# Altium project ENZ_Zdroj.PrjPcb
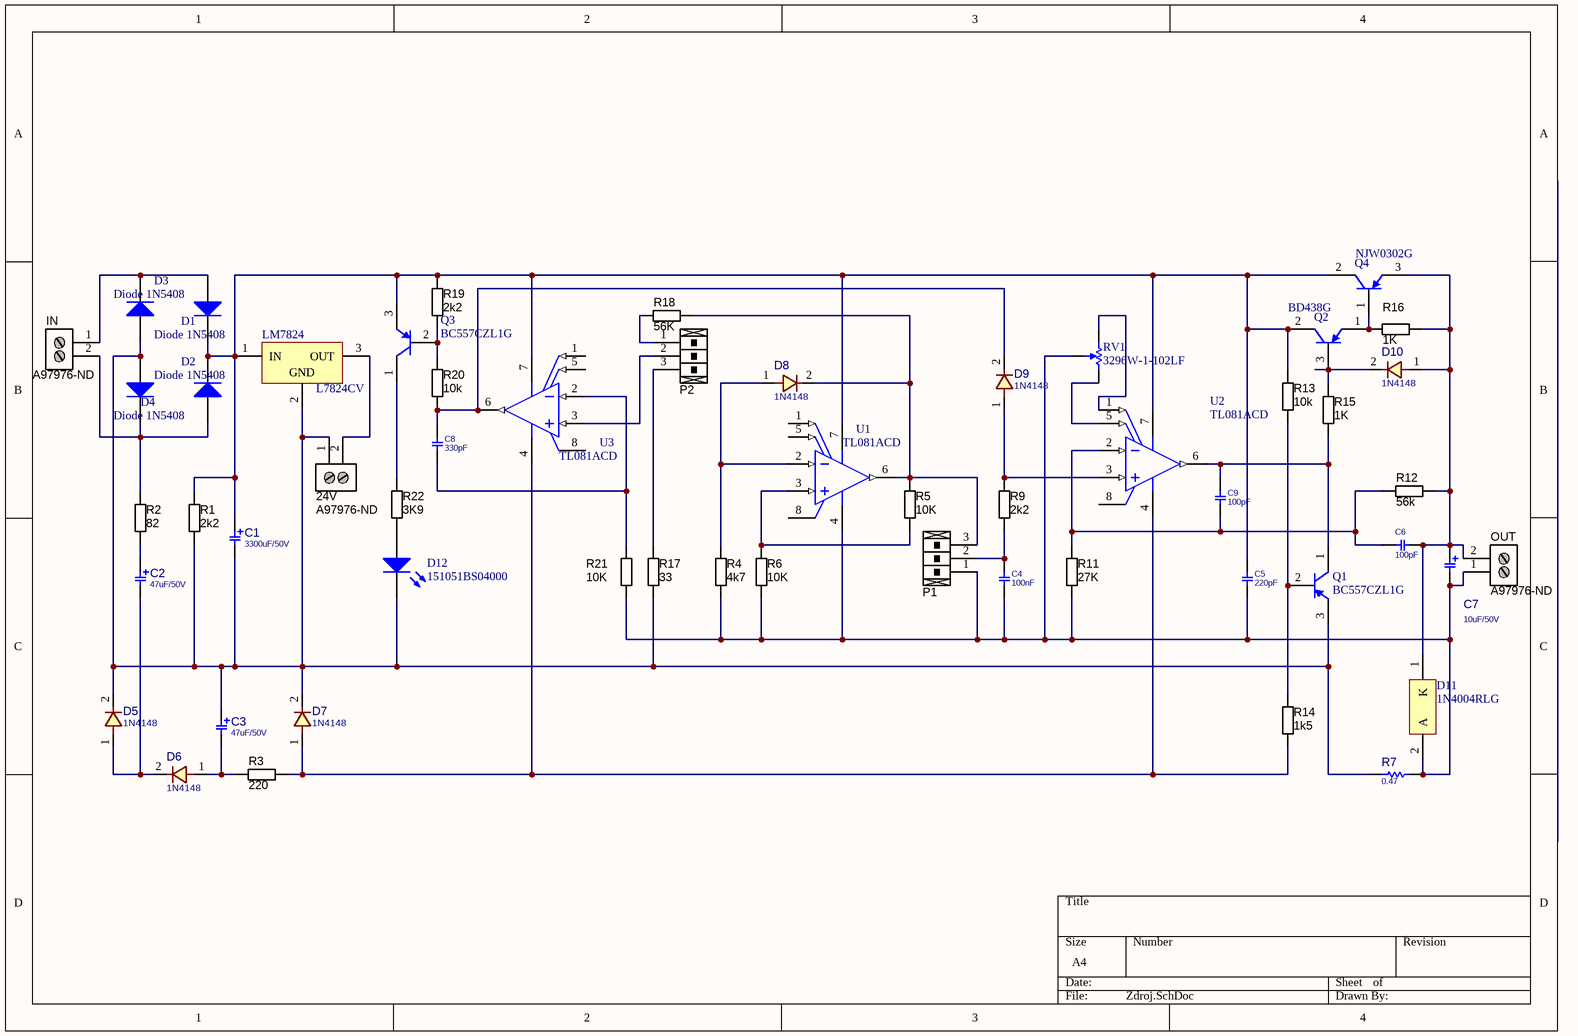
[diagram p0: Zdroj.SchDoc]
1 sheet, 55 parts. Net scope: global (net labels, ports and power ports of the same name join across sheets).
Board file: ENZ_Zdroj_PCB.PcbDoc

## Sheet Zdroj.SchDoc
size A4

### Parts
24V  Supplier Part Number 1: A97976-ND  [2P_PCB_ScrewTerm_90S_3.81MM]  (hidden comment: Stackable ScrewTerm)
C1  3300uF/50V  [C_EL_18X35]
C2  47uF/50V  [C_EL_8X12]
C3  47uF/50V  [C_EL_8X12]
C4  100nF  [C_CER_D3]
C5  220pF  [C_CER_D3]
C6  100pF  [C_CER_D3]
C7  10uF/50V  [C_EL_8X12]
C8  330pF  [C_CER_D3]
C9  100pF  [C_CER_D3]
D1  Diode 1N5408  [DO-201AD]
D2  Diode 1N5408  [DO-201AD]
D3  Diode 1N5408  [DO-201AD]
D4  Diode 1N5408  [DO-201AD]
D5  1N4148  [D_AX02_DO35]
D6  1N4148  [D_AX02_DO35]
D7  1N4148  [D_AX02_DO35]
D8  1N4148  [D_AX02_DO35]
D9  1N4148  [D_AX02_DO35]
D10  1N4148  [D_AX02_DO35]
D11  1N4004RLG  [ONSC-AXIAL_LEAD-2-59-10_P]
D12  151051BS04000  [Type 5mm]
IN  Supplier Part Number 1: A97976-ND  [2P_PCB_ScrewTerm_90S_3.81MM]  (hidden comment: Stackable ScrewTerm)
LM7824  L7824CV  [TO220]
OUT  Supplier Part Number 1: A97976-ND  [2P_PCB_ScrewTerm_90S_3.81MM]  (hidden comment: Stackable ScrewTerm)
P1  3P_TERM BLOCK HEADER  [3P_PCB_TERM_BLOCK_HDR]  (value not drawn)
P2  3P_TERM BLOCK HEADER  [3P_PCB_TERM_BLOCK_HDR]  (value not drawn)
Q1  BC557CZL1G  [ONSC-TO-92-3-29-11_AM_BL]
Q2  BD438G  [ONSC-TO-225-3-77-09]
Q3  BC557CZL1G  [ONSC-TO-92-3-29-11_AM_BL]
Q4  NJW0302G  [ONSC-TO-3P-3LD-3-340AB-01]
R1  value 2k2  [RESTH_AXIAL-0.4]  (hidden comment: Carbon Film)
R2  value 82  [RESTH_AXIAL-0.4]  (hidden comment: Carbon Film)
R3  value 220  [RESTH_AXIAL-0.4]  (hidden comment: Carbon Film)
R4  value 4k7  [RESTH_AXIAL-0.4]  (hidden comment: Carbon Film)
R5  value 10K  [RESTH_AXIAL-0.4]  (hidden comment: Carbon Film)
R6  value 10K  [RESTH_AXIAL-0.4]  (hidden comment: Carbon Film)
R7  0.47  [RWW5W]
R9  value 2k2  [RESTH_AXIAL-0.4]  (hidden comment: Carbon Film)
R11  value 27K  [RESTH_AXIAL-0.4]  (hidden comment: Carbon Film)
R12  value 56k  [RESTH_AXIAL-0.4]  (hidden comment: Carbon Film)
R13  value 10k  [RESTH_AXIAL-0.4]  (hidden comment: Carbon Film)
R14  value 1k5  [RESTH_AXIAL-0.4]  (hidden comment: Carbon Film)
R15  value 1K  [RESTH_AXIAL-0.4]  (hidden comment: Carbon Film)
R16  value 1K  [RESTH_AXIAL-0.4]  (hidden comment: Carbon Film)
R17  value 33  [RESTH_AXIAL-0.4]  (hidden comment: Carbon Film)
R18  value 56K  [RESTH_AXIAL-0.4]  (hidden comment: Carbon Film)
R19  value 2k2  [RESTH_AXIAL-0.4]  (hidden comment: Carbon Film)
R20  value 10k  [RESTH_AXIAL-0.4]  (hidden comment: Carbon Film)
R21  value 10K  [RESTH_AXIAL-0.4]  (hidden comment: Carbon Film)
R22  value 3K9  [RESTH_AXIAL-0.4]  (hidden comment: Carbon Film)
RV1  3296W-1-102LF  [BOUR-3296W-1-3]
U1  TL081ACD  [D0008A_M]
U2  TL081ACD  [D0008A_M]
U3  TL081ACD  [D0008A_M]

### Nets
Net24V_1: 24V.1 C1.2 C3.1 D3.1(A) D4.1(A) D5.2 D7.2 D12.1(K) LM7824.2(GND) Q1.3(E) R1.2 R7.1 R17.2
Net24V_2: 24V.2 LM7824.3(OUT)
NetC1_1: C1.1 C5.2 D1.2(K) D2.2(K) LM7824.1(IN) Q2.2(C) Q3.3(E) Q4.2(C) R1.1 R13.1 R19.1 U1.7(VCC+) U2.7(VCC+) U3.7(VCC+)
NetC2_1: C2.1 R2.2
NetC2_2: C2.2 D5.1 D6.2
NetC3_2: C3.2 D6.1 R3.1
NetC4_1: C4.1 C5.1 C7.2 D11.2(A) OUT.1 P1.1 R4.2 R6.2 R7.2 R11.2 R21.2 RV1.3(TAP) U1.4(VCC-)
NetC4_2: C4.2 P1.2 R9.2
NetC6_1: C6.1 C7.1 D10.1 D11.1(K) OUT.2 Q4.3(E) R12.2 R16.2
NetC6_2: C6.2 C9.1 R11.1 R12.1 U2.2(IN-)
NetC8_1: C8.1 R21.1 U3.2(IN-)
NetC8_2: C8.2 D9.2 R20.2 U3.6(OUT)
NetC9_2: C9.2 Q1.1(C) R15.2 U2.6(OUT)
NetD1_1: D1.1(A) D3.2(K) IN.1
NetD2_1: D2.1(A) D4.2(K) IN.2 R2.1
NetD7_1: D7.1 R3.2 R14.2 U2.4(VCC-) U3.4(VCC-)
NetD8_1: D8.1 R4.1 U1.2(IN-)
NetD8_2: D8.2 P1.3 R5.2 R18.2 U1.6(OUT)
NetD9_1: D9.1 R9.1 U2.3(IN+)
NetD10_2: D10.2 Q2.3(B) R15.1
NetD12_2: D12.2(A) R22.2
NetP2_1: P2.1 R18.1
NetP2_2: P2.2 U3.3(IN+)
NetP2_3: P2.3 R17.1
NetQ1_2: Q1.2(B) R13.2 R14.1
NetQ2_1: Q2.1(E) Q4.1(B) R16.1
NetQ3_1: Q3.1(C) R22.1
NetQ3_2: Q3.2(B) R19.2 R20.1
NetR5_1: R5.1 R6.1 U1.3(IN+)
NetRV1_1: RV1.1(A) U2.1(OFFSET_N1)
NetRV1_2: RV1.2(B) U2.5(OFFSET_N2)

Not connected (* = marked no-connect by the designer): U1 1(OFFSET_N1) 5(OFFSET_N2) 8(NC); U2 8(NC); U3 1(OFFSET_N1) 5(OFFSET_N2) 8(NC)

### Library data of the parts
24V IN OUT = 2P_ScrewTerm_90S_3.81MM: Terminal Block Screw Type THT 2-Position 3.81mm pitch; Manufacturer 1: Tyco Electronics; Manufacturer Part Number 1: 1776113-2; Value: 2 position; Pitch: 0.150" (3.81mm); Positions Per Level: 2; SCDType: undef; Package / Case: Side Entry; 3.81mm pitch; Category: Connectors Interconnects; Color: Black; Supplier 1: Digi-Key
C1-C3 C7 = CAP_THD_EL: CAP, THD, ELEC,; MANF_P#: MANF_PART#; PARAM2: 20%; DESC: DESCRIPTION; DIST#: MOUSER; PARAM: 25V; PRICE: 10= 5$; MANF: MANF; ASSEMBLY: ASSEMBLY
  C1: VALUE: 3300uF/50V
  C2 C3: VALUE: 47uF/50V
  C7: VALUE: 10uF/50V
C4-C6 C9 = CAP_THD_CERML: CAP, THD, CER MULTI LAYER; PARAM: 50V; DESC: CAP, CER MULTI LAYER,; MANF_P#: MANF_PART#; PRICE: 100= 1$; MANF: MANF; PARAM2: PARAM2; ASSEMBLY: ASSEMBLY
  C4: VALUE: 100nF
  C5: VALUE: 220pF
  C6 C9: VALUE: 100pF
C8 = CAP_THD_CERML: CAP, THD, CER MULTI LAYER,; DESC: CAP, CER MULTI LAYER,; MANF_P#: MANF_PART#; PARAM2: 50V; PRICE: 100= 1$; MANF: MANF; ASSEMBLY: ASSEMBLY; VALUE: 330pF
D1-D4 = Diode 1N5408: 3 Amp Medium Power Silicon Rectifier Diode; Published: 8-Jun-2000; LatestRevisionDate: 17-Jul-2002; LatestRevisionNote: Re-released for DXP Platform.; DatasheetVersion: Aug-1984; PackageReference: DO-201AD; Publisher: Altium Limited; PackageDescription: Diode, Axial; Body 9.5 x 5.3 mm (LxDia. max), Lead Dia. 1.32 mm (max); ComponentLink1Description: Manufacturer Link; ComponentLink1URL: http://www.irf.com/
D5-D10 = DIODE_THD_1N4148: DIODE, FAST SWTICHING, THD; DESC: DESCRIPTION; PARAM: 75V; PARAM2: 0.3A; MANF: MANF; ASSEMBLY: ASSEMBLY; PRICE: PRICE; MANF_P#: 1N4148; VALUE: 1N4148
D11 = CMP-0902-00098-1: Standard Recovery Rectifier, 2-Pin Axial_Lead, Pb-Free, Tape and Reel; Manufacturer: On Semiconductor; IO(rec) Max (A): 1; IFSM Max (A): 30; VRRM Max (V): 400; ComponentLink2Description: Datasheet; Packing: Tape and Reel; PackageReference: AXIAL_LEAD-2-59-10; PackageDescription: 2-Pin, Axial Lead, Diameter 2.35 mm; DatasheetVersion: Rev. 13; ComponentLink2URL: http://www.onsemi.com/pub_link/Collateral/1N4001-D.PDF; Type: Standard Recovery; PartNumber: 1N4004RLG; ComponentLink3Description: Package Specification; ComponentLink3URL: http://www.onsemi.cn/pub_link/Collateral/59-10.PDF; ComponentLink1Description: Manufacturer URL; RoHS: TRUE; PackageVersion: Rev. U, 02/2005; ComponentLink1URL: http://www.onsemi.com/; Mounting Technology: Through Hole
D12 = CMP-1488-00009-1: THT LED round mono-color color lens, WL-TMRW, Blue; Manufacturer: Wuerth Elektronik; PackageReference: Type 5mm; ComponentLink2Description: Datasheet; ComponentLink1Description: Manufacturer URL; Emitting color: Blue; ComponentLink1URL: http://www.we-online.com; PartNumber: 151051BS04000; ComponentLink2URL: http://katalog.we-online.de/pbs/datasheet/7448042001.pdfhttp://katalog.we-online.de/pbs/datasheet/7448042001.pdfhttp://katalog.we-online.de/pbs/datasheet/7448042001.pdfhttp://katalog.we-online.de/pbs/datasheet/151051BS04000.pdf
LM7824 = CMP-0244-00424-1: Positive Voltage Regulator, 24V, 3-Pin TO-220; ComponentLink3Description: Package Specification; DatasheetVersion: 16/11/2011; ComponentLink1Description: Manufacturer URL; PackageReference: TO220; ComponentLink2Description: Datasheet; PackageVersion: ver3.0; ComponentLink3URL: http://www.st.com/internet/com/TECHNICAL_RESOURCES/TECHNICAL_LITERATURE/PACKAGE_INFORMATION/CD00004649.pdf; ComponentLink1URL: http://www.st.com; PackageDescription: TO, Thru-Hole, Vertical, Heatsink Mounted; 3 In-Line Leads; Pitch 2.54 mm; ComponentLink2URL: http://www.st.com/internet/com/TECHNICAL_RESOURCES/TECHNICAL_LITERATURE/DATASHEET/CD00000444.pdf
P1 P2 = 3P_TERM BLOCK HEADER: Terminal Block THT 3-Position header 3.81mm pitch; Manufacturer 1: TE Connectivity; Manufacturer Part Number 1: 284517-3; Pitch: 0.150" (3.81mm); Voltage: 300V; Mating Connector: 284507-3; Value: 3 position; Positions Per Level: 3; SCDType: undef; Category: Connectors; Mounting Type: Through Hole; Terminal Block Type: Header, Male Pins, Shrouded (4 Side); Package / Case: Side Entry; 3.81mm pitch; Supplier 1: Digi-Key; Supplier Part Number 1: A98411-ND; ComponentLink1URL: http://www.te.com/commerce/DocumentDelivery/DDEController?Action=srchrtrv&DocNm=284517&DocType=Customer+Drawing&DocLang=English; ComponentLink1Description: http://www.te.com/commerce/DocumentDelivery/DDEController?Action=srchrtrv&DocNm=284517&DocType=Customer+Drawing&DocLang=English
Q1 Q3 = CMP-1048-01521-1: Amplifier Transistor, PNP Silicon, 3-Pin TO-92, Pb-Free, Ammo Box; Manufacturer: On Semiconductor; IC Continuous (A): -0.1; ComponentLink2Description: Datasheet; ComponentLink1URL: http://www.onsemi.com/; Mounting Technology: Through Hole; PartNumber: BC557CZL1G; Packing: Ammo Box; DatasheetVersion: Rev. 3; PackageVersion: Rev. AM; ComponentLink3URL: http://www.onsemi.com/pub_link/Collateral/MAC97-D.PDF; ComponentLink1Description: Manufacturer URL; Polarity: PNP; RoHS: TRUE; PackageReference: TO-92-3-29-11_AM_BL; PackageDescription: 3-Pin Transistor Outline, Body 4.825 x 3.685 mm, Pitch 1.27 mm; ComponentLink2URL: http://www.onsemi.com/pub_link/Collateral/BC556B-D.PDF; ComponentLink3Description: Package Specification
Q2 = CMP-1048-01245-1: Plastic Medium Power Silicon PNP Transistor, 3-Pin TO-225, Pb-Free, Bulk Box; Manufacturer: On Semiconductor; fT Min (MHz): 3; IC Continuous (A): 4; ComponentLink2URL: http://www.onsemi.com/pub_link/Collateral/BD438-D.PDF; PackageDescription: 3-Pin Flange Mount, Vertical Straight Lead, Body 7.6 x 2.7 mm, Pitch 2.29 mm; Mounting Technology: Through Hole; ComponentLink1Description: Manufacturer URL; Packing: Bulk Box; ComponentLink3Description: Package Specification; Polarity: PNP; ComponentLink3URL: http://www.onsemi.com/pub_link/Collateral/77-09.PDF; PartNumber: BD438G; DatasheetVersion: Rev. 15; ComponentLink2Description: Datasheet; RoHS: TRUE; ComponentLink1URL: http://www.onsemi.com/; PackageVersion: Rev. AC, 12/2013; PackageReference: TO-225-3-77-09
Q4 = CMP-1046-00121-1: Complementary PNP Power Bipolar Transistor, 3-Pin TO-3P-3LD, Pb-Free, Tube; Manufacturer: On Semiconductor; IC Continuous (A): 15; hFE Max: 150; fT Min (MHz): 30; PackageReference: TO-3P-3LD-3-340AB-01; PackageVersion: Rev. A, 10/2007; Packing: Tube; Polarity: PNP; ComponentLink2URL: http://www.onsemi.com/pub_link/Collateral/NJW0281-D.PDF; ComponentLink1URL: http://www.onsemi.com/; ComponentLink3Description: Package Specification; DatasheetVersion: Rev. 1; PackageDescription: 3-Pin Flange Mount, Vertical Straight Lead, Body 15.6 x 4.8 mm, Pitch 5.45 mm; ComponentLink3URL: http://www.onsemi.com/pub_link/Collateral/340AB.PDF; ComponentLink1Description: Manufacturer URL; Mounting Technology: Through Hole; PartNumber: NJW0302G; ComponentLink2Description: Datasheet; RoHS: TRUE
R1-R6 R9 R11-R22 = RES_1K_Axial_0.25W_5%: Resistor THD Axial 1k Ohm 0.25W 5% Carbon Film; Manufacturer 1: Yageo; Manufacturer Part Number 1: CFR-25JB-1K0; Ratings: 1/4W; SCDType: spec; Tolerance: ±5%; Package / Case: Axial; Supplier 1: Digi-Key; Supplier Part Number 1: 1.0KQBK-ND
R7 = RES_THD: RES, THD; MANF_P#: RK73H1ETTP4701F; MANF: KOA SPEER; PARAM: 0.063W; DESC: DESCRIPTION; DIST#: MOUSER; PARAM2: 1%; ASSEMBLY: ASSEMBLY; PRICE: 100= 0.5$; VALUE: 0.47
RV1 = CMP-1747-00002-1: Square Trimpot(R) Trimming Potentiometer, 1000 Ohm, -55 to 125 degC, 3-Pin THD, RoHS, Tube; Case\Package: 0603; Tolerance: 1%; Power Rating: 100 mW; Voltage Rating: 75 V; Resistance: 4.7 kohm; ComponentLink2URL: http://www.bourns.com/docs/Product-Datasheets/3296.pdf; Packaging: Tape and Reel; REACH SVHC: Yes; ComponentLink1URL: http://www.bourns.com/; Case Code (Metric): 1608; Width: 0.8 mm; ComponentLink1Description: Manufacturer URL; DatasheetVersion: May-16; Max Operating Temperature: 155 degC; PackageReference: 3296W-1-3; PackageDescription: 3-Pin Through Hole Device, Body 9.53 x 4.83 mm, Pitch 2.54 mm; Weight: 7.1E-05 oz; ComponentLink2Description: Datasheet; RoHSCompliant: true; Min Operating Temperature: -55 degC; Radiation Hardening: No; Case Code (Imperial): 0603; Length: 1.6 mm; Package Quantity: 5000; Pins: 2; Mount: Surface Mount; Height: 0.45 mm
U1-U3 = CMP-0017-00501-2: JFET-Input Operational Amplifier, 7 to 36 V, 0 to 70 degC, 8-pin SOIC (D8), Green (RoHS & no Sb/Br); Manufacturer: Texas Instruments; Number of Channels: 1; Offset Drift(Typ)(uV/C): 18; Sub Family: General Purpose Amplifier, High Supply Voltage Amplifier (>=30V); IIB(Max)(pA): 200; Total Supply Voltage(Min)(+5V is 5, +/-5V is 10): 7; Vio (25C)(Max)(mV): 6; Rating: Catalog; CMRR(Min)(dB): 75; Iq per channel(Max)(mA): 2.8; Total Supply Voltage(Max)(+5V is 5, +/-5V is 10): 36; Slew Rate(Typ)(V/us): 13; GBW(Typ)(MHz): 3; Eco-Plan: Green (RoHS & no Sb/Br); ComponentLink2URL: http://www.ti.com/lit/ds/symlink/tl081a.pdf; PackageDescription: 8-Pin Plastic Small Outline, Body 4.9 x 3.9 mm, Pitch 1.27 mm; DatasheetVersion: SLOS081G; PackageReference: D0008A; Vn at 1kHz(Typ)(nV/rtHz): 18; ComponentLink3Description: Package Specification; PackageVersion: 4040047-3/M, 06/2011; Code_JEDEC: MS-012; ComponentLink2Description: Datasheet; PartNumber: TL081ACD; ComponentLink1Description: Manufacturer URL; Mounting Technology: Surface Mount; ComponentLink1URL: http://www.ti.com/; ComponentLink3URL: http://www.ti.com/litv/pdf/msoi002j